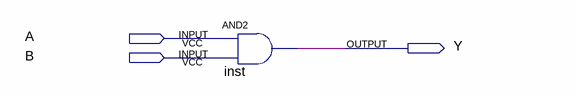
[diagram p0: schematic sheet]
// Quartus schematic CONG_AND.bdf as structural Verilog: 1 symbols, 3 pins
module CONG_AND (
  input  A,
  input  B,
  output Y
);

  and inst (Y, A, B);
endmodule
